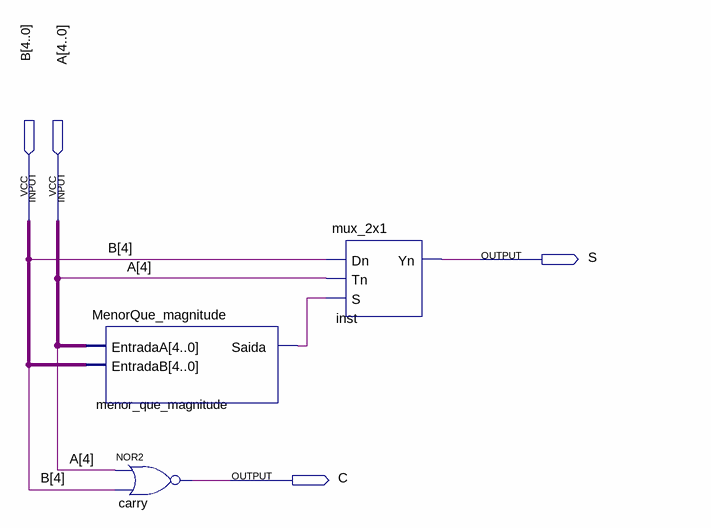
[diagram p0: schematic sheet]
// Quartus schematic teste_sinal.bdf as structural Verilog: 3 symbols, 4 pins
module teste_sinal (
  input  [4:0] B,
  input  [4:0] A,
  output S,
  output C
);

  wire menor_que_magnitude_saida;

  MenorQue_magnitude menor_que_magnitude (.EntradaA(A), .EntradaB(B), .Saida(menor_que_magnitude_saida));
  nor carry (C, A[4], B[4]);
  mux_2x1 inst (.Dn(B[4]), .Tn(A[4]), .S(menor_que_magnitude_saida), .Yn(S));
endmodule
